# EAGLE design miniprinter z carriage (EAGLE 9.4.2)
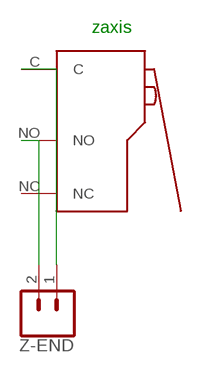
[diagram p0: schematic, sheet 1]

## Parts
U$3  Lever Microswitch Leftangle PCB mount, with Roller style lever, with a red roller  LEVERMICROPCBLEFTANGLE  [LEVERMICROPCB-LEFTANGLE]
Z-END  CONN_023.5MM_LOCK  [SCREWTERMINAL-3.5MM-2_LOCK]

## Nets
N$58: U$3.C Z-END.1
N$59: U$3.NO Z-END.2
Unconnected: U$3.NC

## Notes on the sheet
- zaxis

## Library data of the parts
U$3 = Lever Microswitch Right Angle:LEVERMICROPCB
Z-END = SparkFun-Connectors:CONN_02: Multi connection point. Often used as Generic Header-pin footprint for 0.1 inch spaced/style header connections On any of the 0.1 inch spaced packages, you can populate with these: Break Away Headers - Straight <https://www.sparkfun.com/products/116> (PRT-00116) Break Away Male Headers - Right Angle <https://www.sparkfun.com/products/553> (PRT-00553) Female Headers <https://www.sparkfun.com/products/115> (PRT-00115) Break Away Headers - Machine Pin <https://www.sparkfun.com/products/117> (PRT-00117) Break Away Female Headers - Swiss Machine Pin <https://www.sparkfun.com/products/743> (PRT-00743) For SCREWTERMINALS and SPRING TERMINALS visit here: Screw Terimnals on SparkFun.com <https://www.sparkfun.com/search/results?term=Screw+Terminals> (5mm/3.5mm/2.54mm spacing) This device is also useful as a general connection point to wire up your design to another part of your project. Our various solder wires solder well into these plated through hole pads. Hook-Up Wire - Assortment (Stranded, 22 AWG) <https://www.sparkfun.com/products/11375> (PRT-11375) Hook-Up Wire - Assortment (Solid Core, 22 AWG) <https://www.sparkfun.com/products/11367> (PRT-11367) View the entire wire category on our website here <https://www.sparkfun.com/categories/141> Special notes: Molex polarized connector foot print use with: PRT-08233 with associated crimp pins and housings. 2.54_SCREWTERM for use with PRT-10571. 3.5mm Screw Terminal footprints for PRT-08084 5mm Screw Terminal footprints for use with PRT-08432; PROD_ID: CONN-08399

## Net classes
0 default: width 0.203 mm, clearance 0.152 mm

## Board
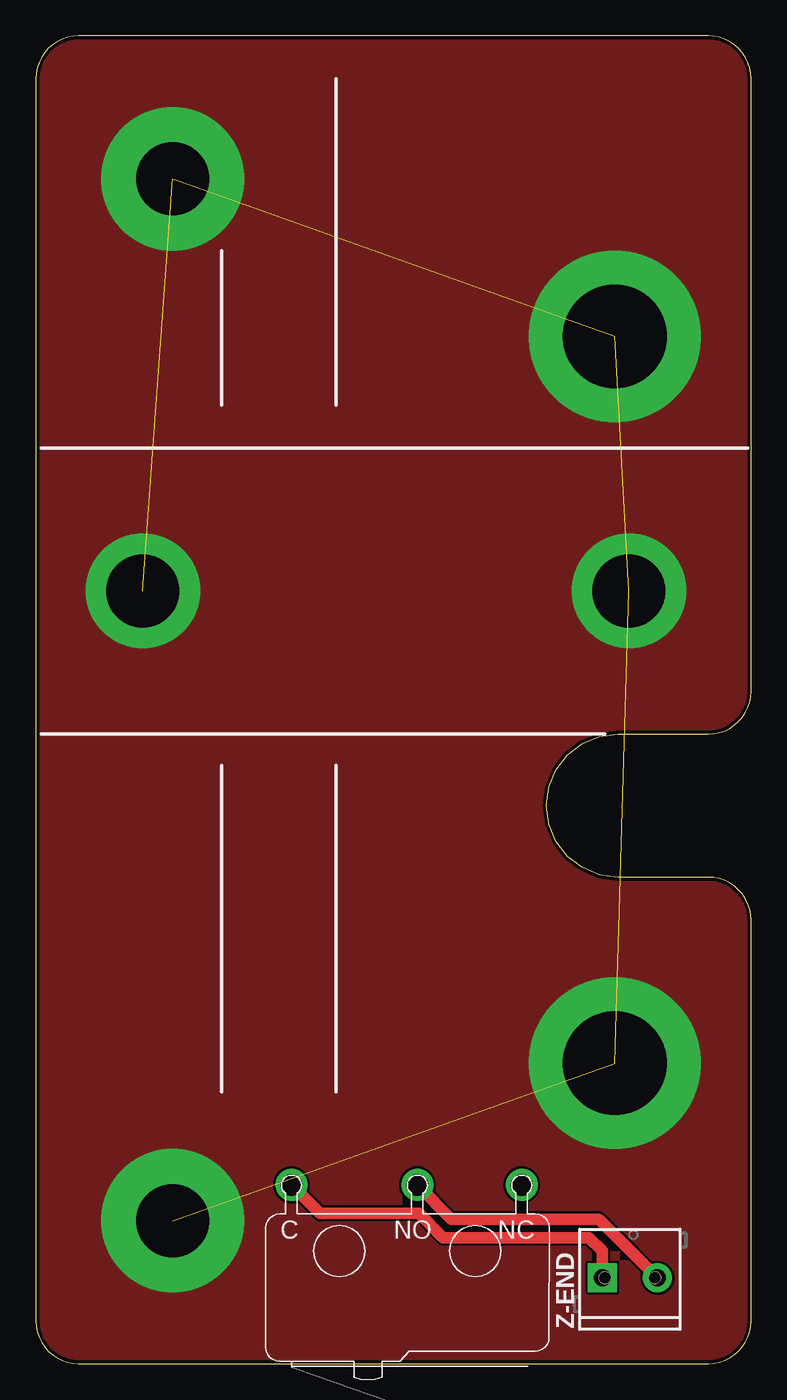
[diagram p1: board, top side]
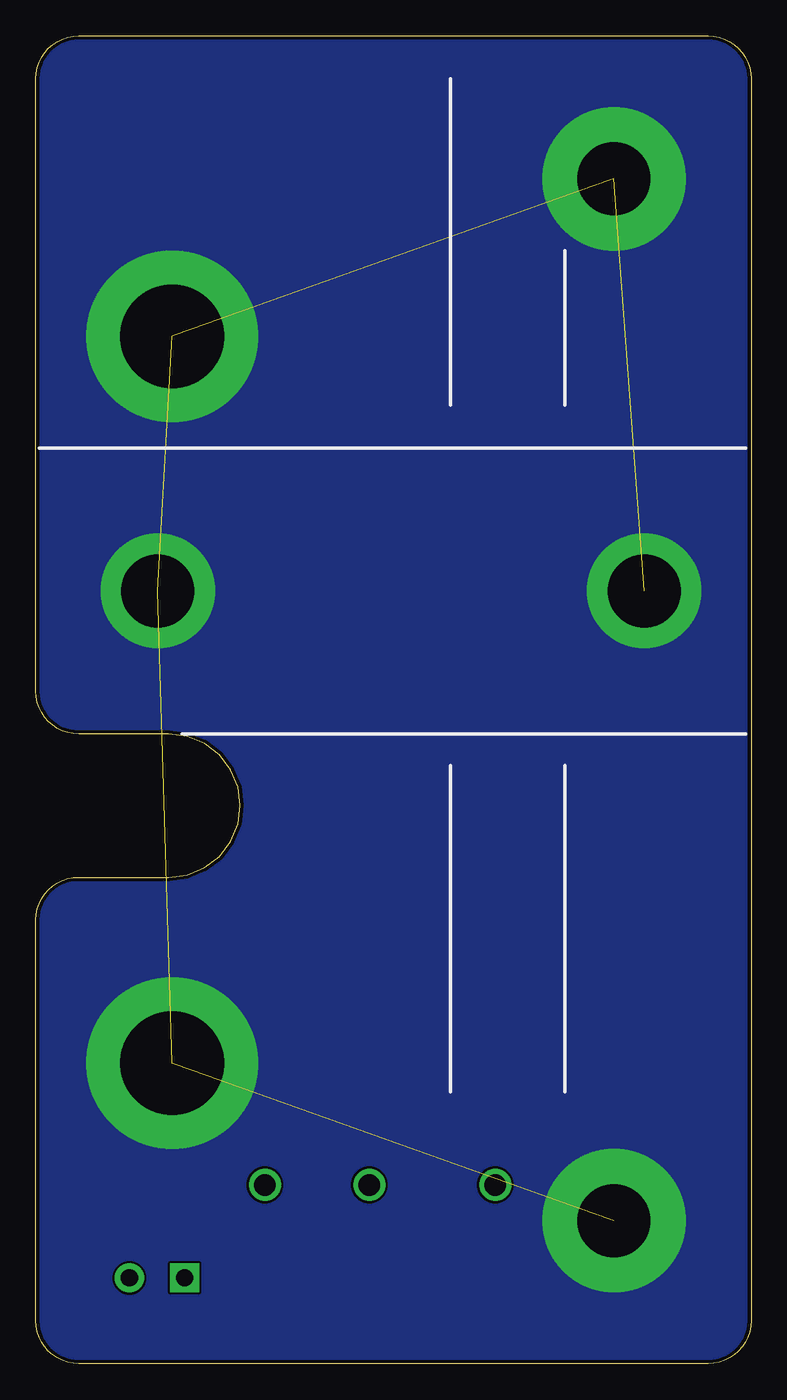
[diagram p2: board, bottom side, seen from below]

Size 50 x 92.8 mm. Coordinates in mm from the lower left corner, seen from the top.
Outline: 50,47 50,89.8 49.97,90.19 49.9,90.58 49.77,90.95 49.6,91.3 49.38,91.63 49.12,91.92 48.83,92.18 48.5,92.4 48.15,92.57 47.78,92.7 47.39,92.77 47,92.8 3,92.8 2.61,92.77 2.22,92.7 1.85,92.57 1.5,92.4 1.17,92.18 0.88,91.92 0.62,91.63 0.4,91.3 0.23,90.95 0.1,90.58 0.03,90.19 0,89.8 0,3 0.03,2.61 0.1,2.22 0.23,1.85 0.4,1.5 0.62,1.17 0.88,0.88 1.17,0.62 1.5,0.4 1.85,0.23 2.22,0.1 2.61,0.03 3,0 47,0 47.39,0.03 47.78,0.1 48.15,0.23 48.5,0.4 48.83,0.62 49.12,0.88 49.38,1.17 49.6,1.5 49.77,1.85 49.9,2.22 49.97,2.61 50,3 50,31 49.97,31.39 49.9,31.78 49.77,32.15 49.6,32.5 49.38,32.83 49.12,33.12 48.83,33.38 48.5,33.6 48.15,33.77 47.78,33.9 47.39,33.97 47,34 40.7,34 39.41,34.17 38.2,34.67 37.16,35.46 36.37,36.5 35.87,37.71 35.7,39 35.87,40.29 36.37,41.5 37.16,42.54 38.2,43.33 39.41,43.83 40.7,44 47,44 47.39,44.03 47.78,44.1 48.15,44.23 48.5,44.4 48.83,44.62 49.12,44.88 49.38,45.17 49.6,45.5 49.77,45.85 49.9,46.22 49.97,46.61 50,47
Copper layers (1*16): Top 0.035mm / dielectric 1.5mm / Bottom 0.035mm
Design rules "default *": minimum track width 6mil, minimum drill 0.35mm, track to track 6mil, track to pad 6mil, pad to pad 6mil, via to via 6mil, smd to smd 6mil, copper to edge 10mil, drill to drill 6mil, minimum pad ring 10mil, minimum via ring 8mil, stop-mask expansion 4mil, vias tented up to drill 0mil, thermal gap 10mil

### Footprints (pad centres in the part's own frame; a part is rotated, then mirrored left to right if it is on the bottom)
LEVERMICROPCB-LEFTANGLE = drill 1.5: C 7.3,-7.1; NC -8.8,-7.1; NO -1.5,-7.1
SCREWTERMINAL-3.5MM-2_LOCK = drill 1.2 pad 2.032 square: 1 -0.178,0 | drill 1.2 pad 2.032: 2 3.678,0

### Placement (x,y rotation side)
U$3  25.17,5.4 180 top
Z-END  39.77,6 0 top

### Tracks (layer width: path | path; a pad name or v marks a point on that pad's centre or on a via)
N$58
  Top 0.813: Z-END.1 39.6,7.88 38.67,8.8 28.47,8.8 26.77,10.5 19.87,10.5 U$3.C
N$59
  Top 0.813: Z-END.2 39.35,10.1 29.07,10.1 U$3.NO
ZCARGND  (via drill 5.1 pad 10, 5.1 pad 8, 7.25 pad 12)  (5 unrouted)
  other vias: 9.57,82.8 40.47,71.8 41.47,54 7.47,54 40.47,21 9.57,10
  pour Top: -0.23,2 -0.23,91 1.77,93 47.77,93 49.77,91 49.77,2 47.77,0 1.77,0
  pour Bottom: -0.23,2 -0.23,91 1.77,93 47.77,93 49.77,91 49.77,2 47.77,0 1.77,0